# Altium schematic sheet PDOC.SchDoc
size A4; SheetNumber: 7; SheetTotal: 10
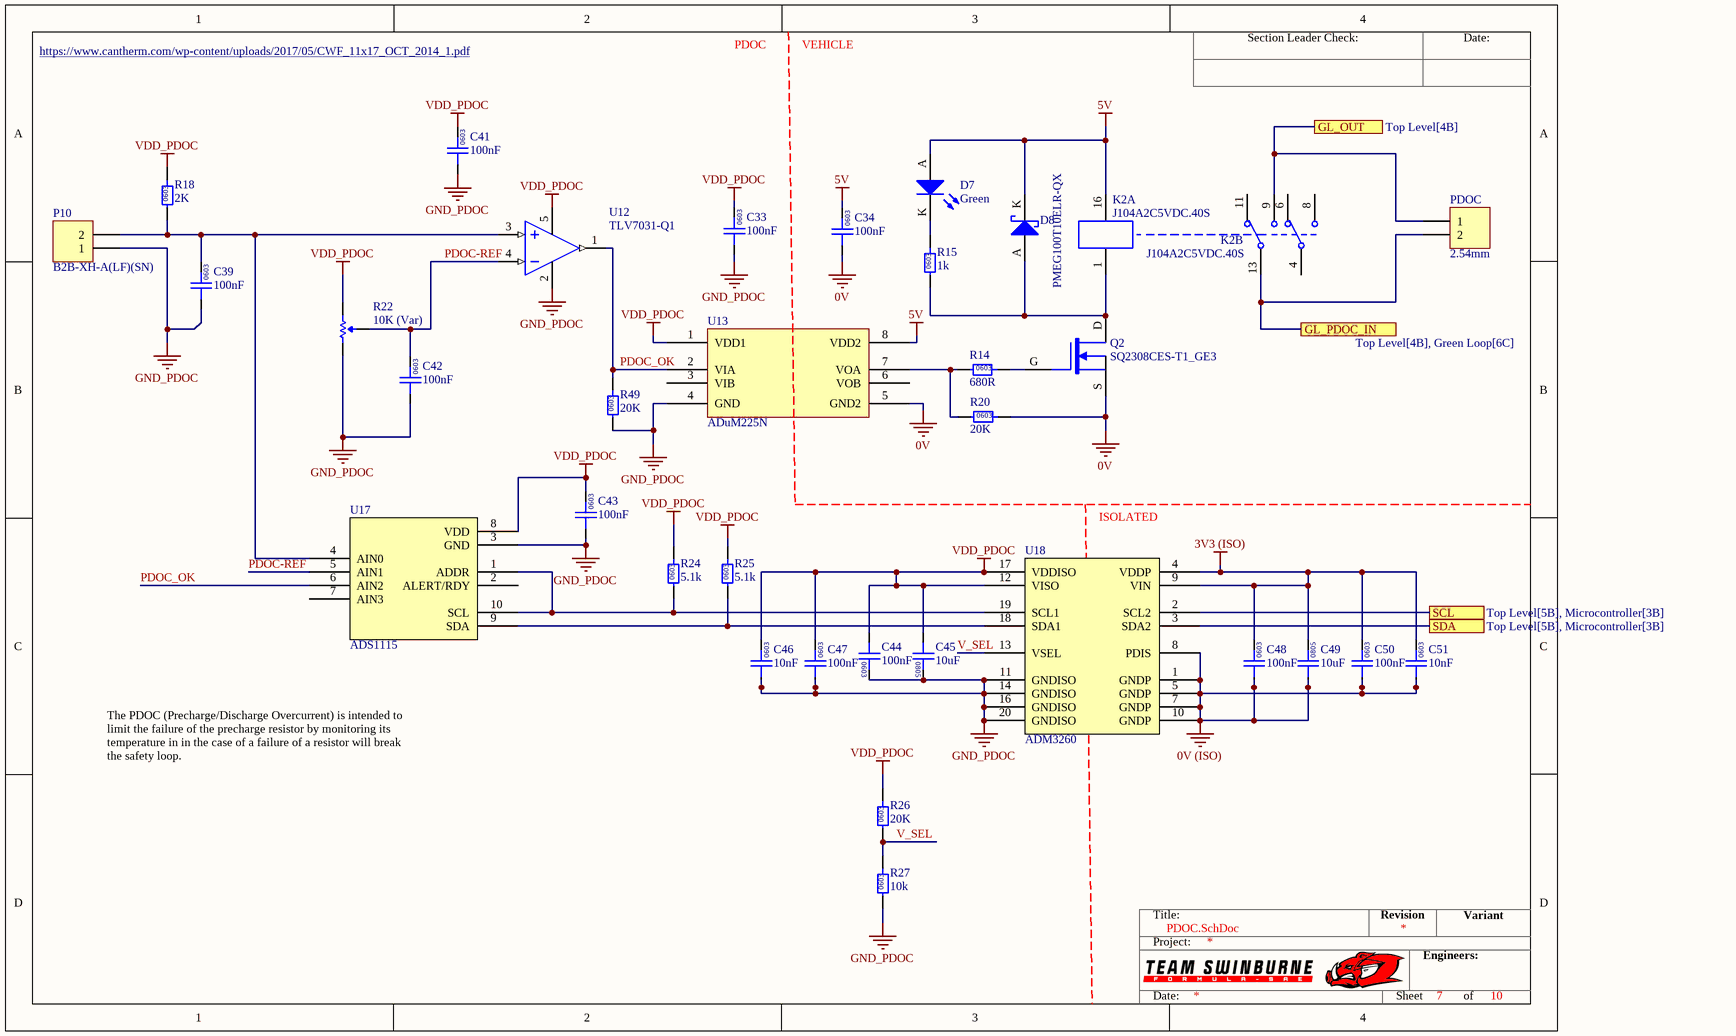
[diagram p0: PDOC.SchDoc]

## Parts
C33  100nF  [0603]
C34  100nF  [0603]
C39  100nF  [0603]
C41  100nF  [0603]
C42  100nF  [0603]
C43  100nF  [0603]
C44  100nF  [0603]
C45  10uF  [0805]
C46  10nF  [0603]
C47  100nF  [0603]
C48  100nF  [0603]
C49  10uF  [0805]
C50  100nF  [0603]
C51  10nF  [0603]
D7  Green  [0805 LED]
D8  PMEG100T10ELR-QX  [NXP SOD123W]
K2  J104A2C5VDC.40S  [TI 2-DIL]  (parts A,B of 2)
P10  B2B-XH-A(LF)(SN)  [XH 2 PIN VERT]
PDOC  2.54mm  [TH 2.54mm Header 1x2]
Q2  SQ2308CES-T1_GE3  [VSHY SOT-23-3]
R14  680R  [0603]
R15  1k  [0603]
R18  2K  [0603]
R20  20K  [0603]
R22  10K (Var)  [B 3296]
R24  5.1k  [0603]
R25  5.1k  [0603]
R26  20K  [0603]
R27  10k  [0603]
R49  20K  [0603]
U12  TLV7031-Q1  [TI SOT-23-5]
U13  ADuM225N  [AD-SOIC-8W]
U17  ADS1115  [TI 10-VSSOP]
U18  ADM3260  [AD 20-SSOP]

## Ports
GL_OUT (see Top Level[4B]), GL_PDOC_IN (see Top Level[4B], Green Loop[6C]), SCL (see Top Level[5B], Microcontroller[3B]), SDA (see Top Level[5B], Microcontroller[3B])

## Nets
0V: C34.1 Q2.S R20.2 U13.5(GND2)
0V (ISO): C48.1 C49.1 C50.1 C51.1 U18.1(GNDP) U18.5(GNDP) U18.7(GNDP) U18.8(PDIS) U18.10(GNDP)
3V3 (ISO): C48.2 C49.2 C50.2 C51.2 U18.4(VDDP) U18.9(VIN)
5V: C34.2 D7.A D8.K K2.16 U13.8(VDD2)
GND_PDOC: C33.1 C39.1 C41.1 C42.1 C43.1 C44.2 C45.2 C46.1 C47.1 P10.1 R22.3(CW) R27.1 R49.1 U12.2(V-) U13.4(GND) U17.3(GND) U18.11(GNDISO) U18.14(GNDISO) U18.16(GNDISO) U18.20(GNDISO)
VDD_PDOC: C33.2 C41.2 C43.2 C44.1 C45.1 C46.2 C47.2 R18.2 R22.1(CCW) R24.2 R25.2 R26.2 U12.5(Vcc) U13.1(VDD1) U17.8(VDD) U18.12(VISO) U18.17(VDDISO)
GL_OUT: K2.9 PDOC.1 ; port GL_OUT
GL_PDOC_IN: K2.13 PDOC.2 ; port GL_PDOC_IN
PDOC-REF: C42.2 R22.2(Wiper) U12.4(IN-) U17.5(AIN1)
PDOC_OK: R49.2 U12.1(OUT) U13.2(VIA) U17.6(AIN2)
SCL: U18.2(SCL2) ; port SCL
SDA: U18.3(SDA2) ; port SDA
V_SEL: R26.1 R27.2 U18.13(VSEL)
NetC39_2: C39.2 P10.2 R18.1 U12.3(IN+) U17.4(AIN0)
NetD7_K: D7.K R15.2
NetD8_A: D8.A K2.1 Q2.D R15.1
NetQ2_G: Q2.G R14.2
NetR14_1: R14.1 R20.1 U13.7(VOA)
NetR24_1: R24.1 U17.1(ADDR) U17.10(SCL) U18.19(SCL1)
NetR25_1: R25.1 U17.9(SDA) U18.18(SDA1)

Not connected (* = marked no-connect by the designer): K2 4 6 8 11; U13 3(VIB) 6(VOB); U17 2(ALERT/RDY) 7(AIN3)

## Notes on the sheet
- https://www.cantherm.com/wp-content/uploads/2017/05/CWF_11x17_OCT_2014_1.pdf
- PDOC
- VEHICLE
- (near U18) ISOLATED
- The PDOC (Precharge/Discharge Overcurrent) is intended to limit the failure of the precharge resistor by monitoring its temperature in in the case of a failure of a resistor will break the safety loop.
- Section Leader Check:
- Date:
- Title:
- Revision
- Variant
- Project:
- Engineers:
- Sheet
- of
- (in symbol CL10B104KC8NNNC) 0603
- (in symbol GCM188L81H103KA03D) 0603
- (in symbol GCM188L81H104KA57D) 0603
- (in symbol GRM21BR6YA106KE43L) 0805
- (in symbol RC0603FR-071KL) 0603
- (in symbol RC0603FR-072KL) 0603
- (in symbol RC0603FR-0710KL) 0603
- (in symbol RC0603FR-0720KL) 0603
- (in symbol RC0603JR-075K1L) 0603
- (in symbol RC0603JR-13680RL) 0603

## Library data of the parts
C33 C34 = CL10B104KC8NNNC: Manufacturer: Samsung Electro-Mechanics; Rated Voltage: 100V; Tolerance: ±10%; Material: MLCC; Temperature Rating: X7R; Part Number: CL10B104KC8NNNC; Value: 100nF; Digikey Part Number: 1276-6807-6-ND
C39 C41-C44 C47 C48 C50 = GCM188L81H104KA57D: Manufacturer: muRata; Rated Voltage: 50V; Tolerance: ±10%; Material: MLCC; Temperature Rating: X8L; Part Number: GCM188L81H104KA57D; Value: 100nF; Digikey Part Number: 490-6049-1-ND
C45 C49 = GRM21BR6YA106KE43L: Manufacturer: muRata; Rated Voltage: 50V; Tolerance: 10%; Material: MLCC; Temperature Rating: X5R; Part Number: GRM21BR6YA106KE43L; Value: 10uF; Digikey Part Number: 490-10514-6-ND
C46 C51 = GCM188L81H103KA03D: Manufacturer: muRata; Rated Voltage: 50V; Tolerance: ±10%; Material: MLCC; Temperature Rating: X8L; Part Number: GCM188L81H103KA03D; Value: 10nF; Digikey Part Number: 490-GCM188L81H103KA03DCT-ND
D7 = SML-210FTT86: Green LED Indication - Discrete 1.75V 0805 (2012 Metric); Manufacturer: ROHM Semiconductor; Part Number: SML-210FTT86; Colour: Green; Digikey Part Number: 511-1285-1-ND; Digikey Link: https://www.digikey.com/product-detail/en/rohm-semiconductor/SML-210FTT86/511-1285-1-ND/637098
D8 = PMEG100T10ELR-QX: Manufacturer: Nexperia USA Inc.; Forward Voltage: 0.75 V @ 1A; Breakdown Voltage: 100 V; Rated Power: 680 mW; Part Number: PMEG100T10ELR-QX; Digikey Part Number: 1727-PMEG100T10ELR-QXCT-ND
K2 = J104A2C5VDC.40S: RELAY GEN PURPOSE DPDT 3A 5V; Manufacturer: CIT Relay and Switch; Part Number: J104A2C5VDC.40S; Digikey Part Number: 2449-J104A2C5VDC.40S-ND; Digikey Link: https://www.digikey.com.au/en/products/detail/cit-relay-and-switch/J104A2C5VDC-40S/14002119
P10 = B2B-XH-A(LF)(SN): Positions: 2; Pitch: 2.54mm; Angle: 0; Flange: No; Contact: Tin; Part Number: B2B-XH-A(LF)(SN); Row Spacing: 2.54mm; Digikey Part Number: 455-2247-ND; Digikey Link: https://www.digikey.com.au/en/products/detail/jst-sales-america-inc/B2B-XH-A-LF-SN/1651045
PDOC = TH 2.54mm Header 1x2: Positions: 2; Angle: 0; Flange: No; Contact: NA; Part Number: TH 2.54mm Header 1x2; Pitch: 2.54mm; Row Spacing: 2.54mm
Q2 = SQ2308CES-T1_GE3: MOSFET N-CH 60V 2.3A SOT23; Manufacturer: Vishay Siliconix; Type: N-channel; Rated Power: 2W; Published: 24-Mar-1999; LatestRevisionDate: 29-May-2009; LatestRevisionNote: IPC-7351 Footprint Added.; PackageVersion: Sep-2000; PackageReference: SOT-343; Publisher: Altium Limited; PackageDescription: 4-Pin SOT-343 Package 1.3 mm Pitch, 2.1 mm Lead Span; Part Number: SQ2308CES-T1_GE3; Digikey Part Number: SQ2308CES-T1_GE3CT-ND
R14 = RC0603JR-13680RL: Manufacturer: YAGEO; Tolerance: 0.01; Rated Power: 0.1W; Part Number: RC0603JR-13680RL; Value: 680R; Material: FR-07; Digikey Part Number: 13-RC0603JR-13680RLCT-ND
R15 = RC0603FR-071KL: Manufacturer: YAGEO; Tolerance: 0.01; Rated Power: 0.1W; Part Number: RC0603FR-071KL; Value: 1k; Material: FR-07; Digikey Part Number: 311-1.00KHRCT-ND
R18 = RC0603FR-072KL: Manufacturer: YAGEO; Tolerance: 0.01; Rated Power: 0.1W; Part Number: RC0603FR-072KL; Value: 2K; Digikey Part Number: 311-2.00KHRCT-ND; Material: FR-07
R20 R26 R49 = RC0603FR-0720KL: Manufacturer: YAGEO; Tolerance: 0.01; Rated Power: 0.1W; Part Number: RC0603FR-0720KL; Value: 20K; Material: FR-07; Digikey Part Number: 311-20.0KHRCT-ND
R22 = 3296W-1-103LF: Manufacturer: Bournes Inc; Tolerance: 0.1; Rated Power: 0.5W; Part Number: 3296W-1-103LF; Value: 10K (Var); Digikey Part Number: 3296W-103LF-ND
R24 R25 = RC0603JR-075K1L: Manufacturer: YAGEO; Tolerance: 0.01; Rated Power: 0.1W; Part Number: RC0603JR-075K1L; Value: 5.1k; Material: FR-07; Digikey Part Number: 311-5.1KGRCT-ND
R27 = RC0603FR-0710KL: Manufacturer: YAGEO; Tolerance: 0.01; Rated Power: 0.1W; Part Number: RC0603FR-0710KL; Value: 10k; Digikey Part Number: 311-10.0KHRCT-ND; Material: FR-07
U12 = TLV7031-Q1: Manufacturer: Texas Instruments; Input Voltage: 1.6 to 6.5 V; Channels: 1; Output: Push-Pull; Part Number: TLV7031-Q1; Digikey Part Number: 296-TLV7031QDBVRQ1CT-ND
U13 = ADuM225N: DIGITAL ISOLATOR, DUAL CHANNEL; Manufacturer: Analogue Devices; Complex IC: 0; Part Number: ADuM225N
U17 = ADS1115: 16 Bit Analog to Digital Converter 2, 4 Input 1 Sigma-Delta 10-VSSOP; Manufacturer: Texas Instruments; Part Number: ADS1115; Digikey Part Number: 296-38849-1-ND
U18 = CMP-021-000012-1: I²C Digital Isolator 2500Vrms 2 Channel 25kV/µs CMTI 20-SSOP (0.209", 5.30mm Width); Part Number: ADM3260